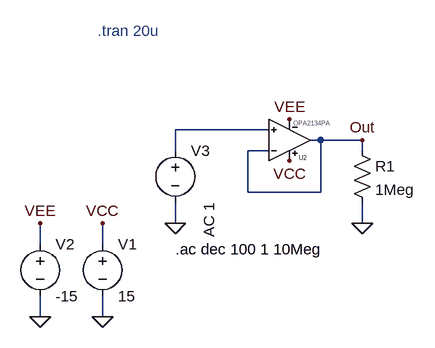
[diagram p0: schematic Test (If Spice works) OP2134PA.asc]
Test (If Spice works) OP2134PA.asc, the LTspice schematic file:
Version 4.1
SHEET 1 880 680
WIRE 240 160 96 160
WIRE 320 176 304 176
WIRE 384 176 320 176
WIRE 96 192 96 160
WIRE 240 192 208 192
WIRE 384 192 384 176
WIRE 208 256 208 192
WIRE 320 256 320 176
WIRE 320 256 208 256
WIRE 96 304 96 272
WIRE 384 304 384 272
WIRE -112 336 -112 304
WIRE -16 336 -16 304
WIRE -112 448 -112 416
WIRE -16 448 -16 416
FLAG -16 304 VCC
FLAG 272 208 VCC
FLAG -112 304 VEE
FLAG 272 144 VEE
FLAG 96 304 0
FLAG 384 176 Out
FLAG 384 304 0
FLAG -112 448 0
FLAG -16 448 0
SYMBOL voltage -16 320 R0
WINDOW 123 0 0 Left 0
WINDOW 39 0 0 Left 0
SYMATTR InstName V1
SYMATTR Value 15
SYMBOL voltage -112 320 R0
WINDOW 123 0 0 Left 0
WINDOW 39 0 0 Left 0
SYMATTR InstName V2
SYMATTR Value -15
SYMBOL voltage 96 176 R0
WINDOW 123 52 96 VRight 2
WINDOW 39 0 0 Left 0
WINDOW 3 24 96 VRight 2
SYMATTR Value2 AC 1
SYMATTR Value ""
SYMATTR InstName V3
SYMBOL res 368 176 R0
SYMATTR InstName R1
SYMATTR Value 1Meg
SYMBOL ZmySymbol\\OP-Amps\\OPA2134PA 272 176 M180
SYMATTR InstName U2
TEXT -24 8 Left 2 ;.tran 20u
TEXT 96 344 Left 2 !.ac dec 100 1 10Meg

The netlist it stands for:
* Test (If Spice works) OP2134PA.asc
V1 VCC 0 15
V2 VEE 0 -15
V3 N001 0 AC 1
R1 Out 0 1Meg
X§U2 N001 Out VCC VEE Out OPAx134  ; pins In+ In- V+ V- OUT
* .tran 20u
.ac dec 100 1 10Meg
.lib OPAx134.lib
.backanno
.end